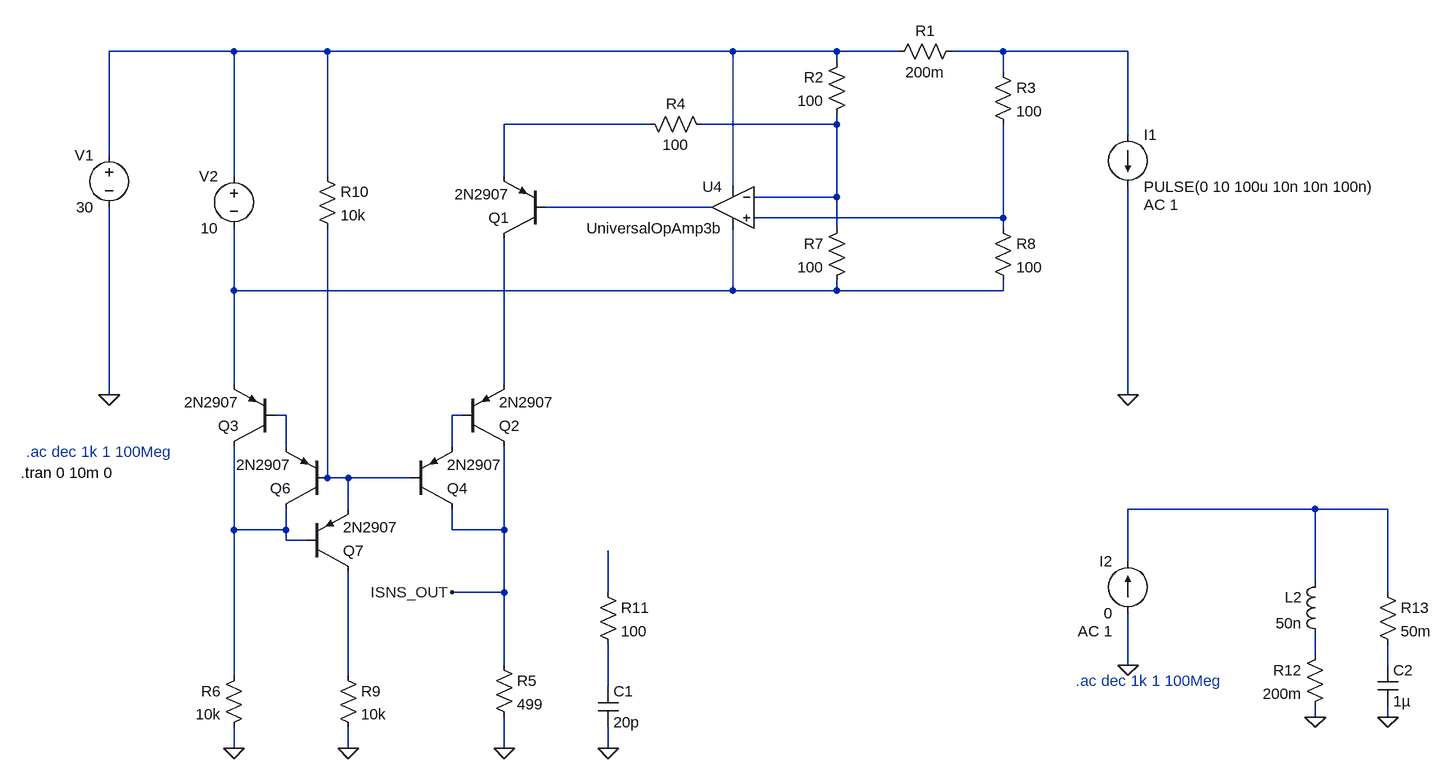
[diagram p0: schematic Current_Sensor_High_Speed.asc]
Current_Sensor_High_Speed.asc, the LTspice schematic file:
Version 4.1
SHEET 1 2472 1044
WIRE 176 -48 -16 -48
WIRE 320 -48 176 -48
WIRE 944 -48 320 -48
WIRE 1104 -48 944 -48
WIRE 1200 -48 1104 -48
WIRE 1360 -48 1280 -48
WIRE 1552 -48 1360 -48
WIRE 1104 -32 1104 -48
WIRE 1360 -16 1360 -48
WIRE 816 64 592 64
WIRE 1104 64 1104 48
WIRE 1104 64 896 64
WIRE 1552 80 1552 -48
WIRE -16 112 -16 -48
WIRE 176 144 176 -48
WIRE 320 144 320 -48
WIRE 592 144 592 64
WIRE 944 160 944 -48
WIRE 1104 176 1104 64
WIRE 1104 176 976 176
WIRE 912 192 656 192
WIRE 1360 208 1360 64
WIRE 1360 208 976 208
WIRE 1104 224 1104 176
WIRE 1360 224 1360 208
WIRE 176 320 176 224
WIRE 944 320 944 224
WIRE 944 320 176 320
WIRE 1104 320 1104 304
WIRE 1104 320 944 320
WIRE 1360 320 1360 304
WIRE 1360 320 1104 320
WIRE 176 464 176 320
WIRE 592 464 592 240
WIRE -16 480 -16 192
WIRE 1552 480 1552 160
WIRE 256 512 240 512
WIRE 528 512 512 512
WIRE 256 560 256 512
WIRE 512 560 512 512
WIRE 320 608 320 224
WIRE 352 608 320 608
WIRE 448 608 352 608
WIRE 352 656 352 608
WIRE 1840 656 1552 656
WIRE 1952 656 1840 656
WIRE 176 688 176 560
WIRE 256 688 256 656
WIRE 256 688 176 688
WIRE 512 688 512 656
WIRE 592 688 592 560
WIRE 592 688 512 688
WIRE 256 704 256 688
WIRE 288 704 256 704
WIRE 1552 736 1552 656
WIRE 1840 768 1840 656
WIRE 592 784 592 688
WIRE 592 784 512 784
WIRE 752 784 752 720
WIRE 1952 784 1952 656
WIRE 1840 880 1840 848
WIRE 592 896 592 784
WIRE 1552 896 1552 816
WIRE 1952 896 1952 864
WIRE 176 912 176 688
WIRE 352 912 352 752
WIRE 752 928 752 864
WIRE 1840 976 1840 960
WIRE 1952 976 1952 960
WIRE 176 1024 176 992
WIRE 352 1024 352 992
WIRE 592 1024 592 976
WIRE 752 1024 752 992
FLAG 1552 480 0
FLAG -16 480 0
FLAG 512 784 ISNS_OUT
FLAG 176 1024 0
FLAG 352 1024 0
FLAG 592 1024 0
FLAG 752 1024 0
FLAG 1840 976 0
FLAG 1552 896 0
FLAG 1952 976 0
SYMBOL voltage -16 96 M0
WINDOW 123 0 0 Left 0
WINDOW 39 0 0 Left 0
SYMATTR InstName V1
SYMATTR Value 30
SYMBOL res 1184 -32 R270
WINDOW 0 32 56 VTop 2
WINDOW 3 0 56 VBottom 2
SYMATTR InstName R1
SYMATTR Value 200m
SYMBOL current 1552 80 R0
WINDOW 123 24 108 Left 2
WINDOW 39 0 0 Left 0
SYMATTR Value2 AC 1
SYMATTR InstName I1
SYMATTR Value PULSE(0 10 100u 10n 10n 100n)
SYMBOL OpAmps\\UniversalOpAmp3b 944 192 M0
SYMATTR InstName U4
SYMATTR Value2 Avol=1Meg GBW=1000Meg Slew=500Meg
SYMATTR SpiceLine Ilimit=25m Rail=50m Vos=0 Phimargin=45
SYMBOL res 1120 -48 M0
SYMATTR InstName R2
SYMATTR Value 100
SYMBOL res 1344 -32 R0
SYMATTR InstName R3
SYMATTR Value 100
SYMBOL res 800 48 M90
WINDOW 0 0 56 VBottom 2
WINDOW 3 32 56 VTop 2
SYMATTR InstName R4
SYMATTR Value 100
SYMBOL res 576 880 R0
SYMATTR InstName R5
SYMATTR Value 499
SYMBOL pnp 528 560 M180
SYMATTR InstName Q2
SYMATTR Value 2N2907
SYMBOL pnp 240 560 R180
SYMATTR InstName Q3
SYMATTR Value 2N2907
SYMBOL res 192 896 M0
SYMATTR InstName R6
SYMATTR Value 10k
SYMBOL voltage 176 128 M0
WINDOW 123 0 0 Left 0
WINDOW 39 0 0 Left 0
SYMATTR InstName V2
SYMATTR Value 10
SYMBOL res 1120 208 M0
SYMATTR InstName R7
SYMATTR Value 100
SYMBOL res 1344 208 R0
SYMATTR InstName R8
SYMATTR Value 100
SYMBOL res 336 896 R0
SYMATTR InstName R9
SYMATTR Value 10k
SYMBOL res 304 128 R0
SYMATTR InstName R10
SYMATTR Value 10k
SYMBOL pnp 448 656 M180
SYMATTR InstName Q4
SYMATTR Value 2N2907
SYMBOL pnp 320 656 R180
SYMATTR InstName Q6
SYMATTR Value 2N2907
SYMBOL pnp 288 752 M180
SYMATTR InstName Q7
SYMATTR Value 2N2907
SYMBOL cap 736 928 R0
SYMATTR InstName C1
SYMATTR Value 20p
SYMBOL res 736 768 R0
SYMATTR InstName R11
SYMATTR Value 100
SYMBOL current 1552 816 R180
WINDOW 0 24 80 Left 2
WINDOW 3 24 0 Left 2
WINDOW 123 24 -28 Left 2
WINDOW 39 0 0 Left 0
SYMATTR InstName I2
SYMATTR Value 0
SYMATTR Value2 AC 1
SYMBOL res 1856 864 M0
SYMATTR InstName R12
SYMATTR Value 200m
SYMBOL ind 1856 752 M0
SYMATTR InstName L2
SYMATTR Value 50n
SYMATTR SpiceLine Rser=1m
SYMBOL cap 1936 896 R0
SYMATTR InstName C2
SYMATTR Value 1µ
SYMBOL res 1936 768 R0
SYMATTR InstName R13
SYMATTR Value 50m
SYMBOL pnp 656 240 R180
SYMATTR InstName Q1
SYMATTR Value 2N2907
TEXT -144 568 Left 2 ;.ac dec 1k 1 100Meg
TEXT -152 600 Left 2 !.tran 0 10m 0
TEXT 1472 920 Left 2 ;.ac dec 1k 1 100Meg

The netlist it stands for:
* Current_Sensor_High_Speed.asc
V1 N001 0 30
R1 N001 N002 200m
I1 N002 0 PULSE(0 10 100u 10n 10n 100n) AC 1
* U4: UniversalOpAmp3b Avol=1Meg GBW=1000Meg Slew=500Meg Ilimit=25m Rail=50m Vos=0 Phimargin=45 (symbol OpAmps\UniversalOpAmp3b not available, pins judged from their places): In+=N006 In-=N004 V+=N001 V-=N007 OUT=N005
R2 N001 N004 100
R3 N002 N006 100
R4 N003 N004 100
R5 ISNS_OUT 0 499
Q2 ISNS_OUT N010 N008 0 2N2907
Q3 N013 N009 N007 0 2N2907
R6 N013 0 10k
V2 N001 N007 10
R7 N004 N007 100
R8 N006 N007 100
R9 N017 0 10k
R10 N001 N011 10k
Q4 ISNS_OUT N011 N010 0 2N2907
Q6 N013 N011 N009 0 2N2907
Q7 N017 N013 N011 0 2N2907
C1 N018 0 20p
R11 N014 N018 100
I2 0 N012 0 AC 1
R12 N015 0 200m
L2 N012 N015 50n Rser=1m
C2 N016 0 1µ
R13 N012 N016 50m
Q1 N008 N005 N003 0 2N2907
.model NPN NPN
.model PNP PNP
.lib standard.bjt
* .ac dec 1k 1 100Meg
.tran 0 10m 0
* .ac dec 1k 1 100Meg
.backanno
.end